# Altium schematic sheet Sheet3.SchDoc
size A4
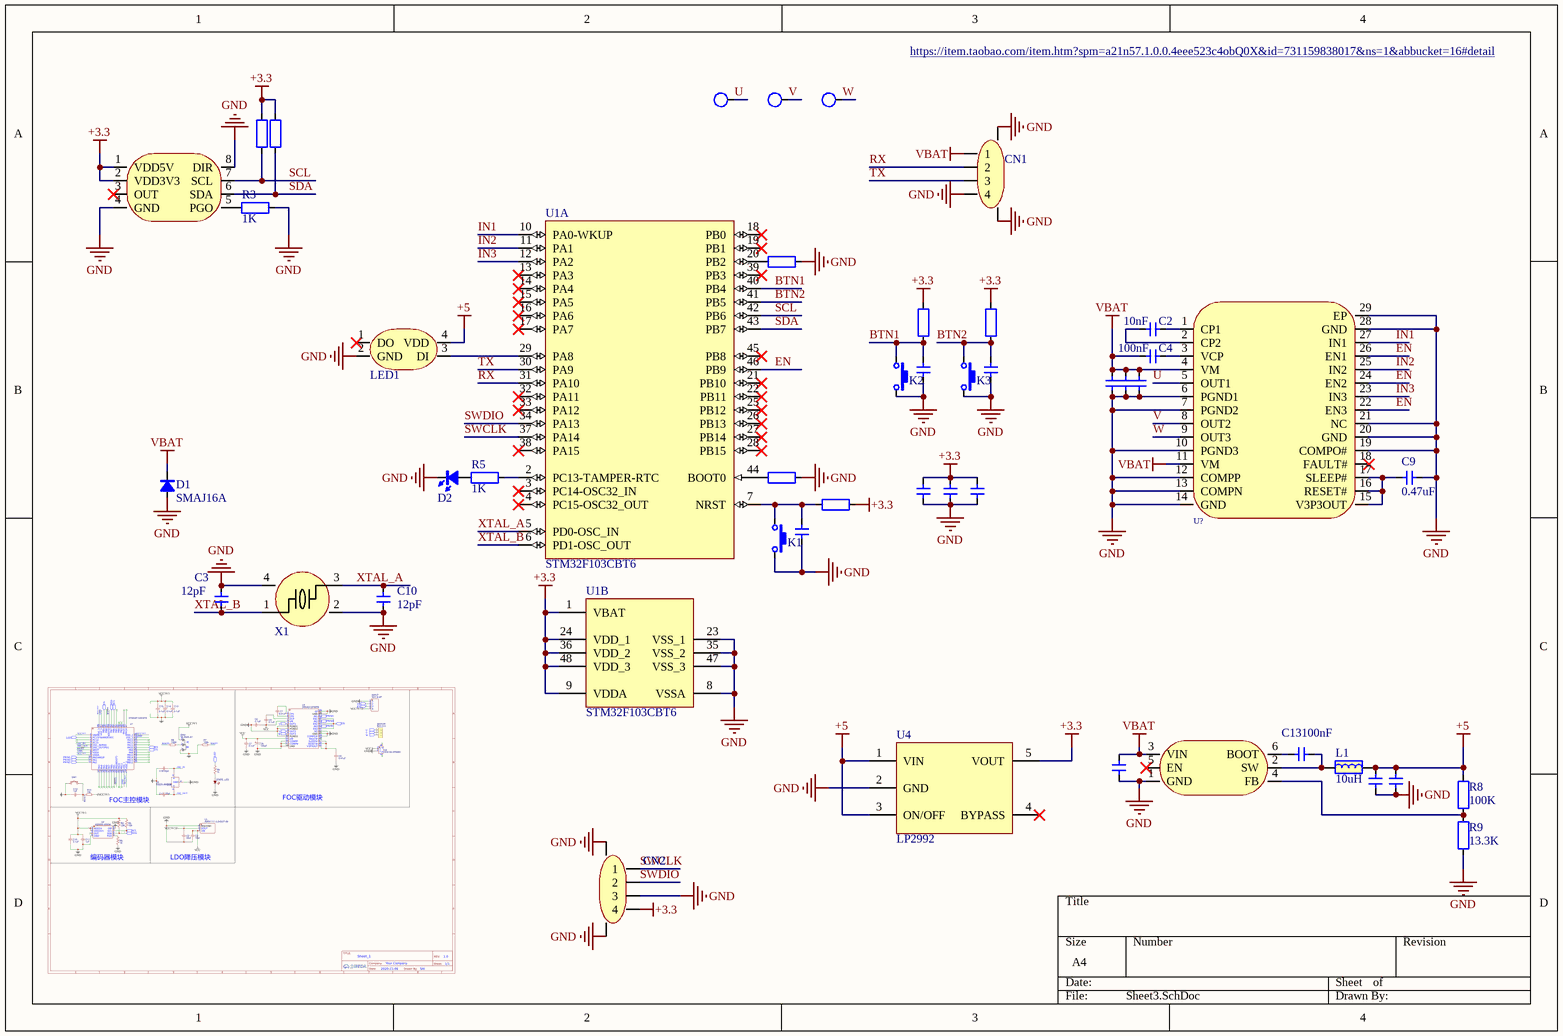
[diagram p0: Sheet3.SchDoc]

## Parts
C1  ?uF  [CAP_0402]  (value not drawn)
C2  10nF  [CAP_0402]
C3  12pF  [CAP_0402]
C4  100nF  [CAP_0402]
C5  ?uF  [CAP_0805]  (value not drawn)
C6  ?uF  [CAP_0805]  (value not drawn)
C7  ?uF  [CAP_0402]  (value not drawn)
C8  ?uF  [CAP_0402]  (value not drawn)
C9  0.47uF  [CAP_0402]
C10  12pF  [CAP_0402]
C11  ?uF  [CAP_0402]  (value not drawn)
C12  ?uF  [CAP_0402]  (value not drawn)
C13  100nF  [CAP_0402]
C14  100nF  [CAP_0402]  (value not drawn)
C15  100nF  [CAP_0603]  (value not drawn)
C16  100nF  [CAP_0603]  (value not drawn)
C17  ?uF  [CAP_0402]  (value not drawn)
C18  ?uF  [CAP_0402]  (value not drawn)
CN1  HDGC1002WR-S-4P  [SH1.0_4P]  (value not drawn)
CN2  HDGC1002WR-S-4P  [SH1.0_4P]  (value not drawn)
D1  SMAJ16A  [SMA]
D2  color?  [LED_0402]  (value not drawn)
K1  TACT 2P  [ButtonTACT_3*4*2_180]  (value not drawn)
K2  TACT 2P  [ButtonTACT_3*4*2_180]  (value not drawn)
K3  TACT 2P  [ButtonTACT_3*4*2_180]  (value not drawn)
L1  10uH  [IND-SMD_L4.0-W4.0]
LED1  WS2812B-2020  [LED-SMD_4P-L2.0-W2.0-TL_WS2812B-2020]  (value not drawn)
R1  1K  [RES_0402]  (value not drawn)
R2  1K  [RES_0402]  (value not drawn)
R3  1K  [RES_0402]
R4  1K  [RES_0402]  (value not drawn)
R5  1K  [RES_0402]
R6  1K  [RES_0402]  (value not drawn)
R7  1K  [RES_0402]  (value not drawn)
R8  100K  [RES_0402]
R9  13.3K  [RES_0402]
R10  1K  [RES_0402]  (value not drawn)
R11  1K  [RES_0402]  (value not drawn)
TEST1  TestPoint  [TestPoint_0402]  (value not drawn)
TEST2  TestPoint  [TestPoint_0402]  (value not drawn)
TEST3  TestPoint  [TestPoint_0402]  (value not drawn)
U1  STM32F103CBT6  [LQFP_48]  (parts A,B of 2)
U3  AS5600-ASOT  [SOIC-8_L4.9-W3.9-P1.27-LS6.0-BL]  (value not drawn)
U4  LP2992  [SOT23_5]
U7  TPS54202DDCR  [SOT-23-6_L2.9-W1.6-P0.95-LS2.8-BR]  (value not drawn)
U?  DRV8313PWPR  [HTSSOP_28]  (value not drawn)
X1  XYDBPCNANF-12MHZ  [CARSTAL_4P_2520]  (value not drawn)

## Nets
+3.3: C8.2 C11.2 C12.2 CN2.4 R1.2 R2.2 R7.1 R10.1 R11.1 U1.1(VBAT) U1.9(VDDA) U1.24(VDD_1) U1.36(VDD_2) U1.48(VDD_3) U3.1(VDD5V) U3.2(VDD3V3) U4.5(VOUT)
+5: C15.1 C16.1 L1.2 LED1.4(VDD) R8.2 U4.1(VIN) U4.3(ON/OFF)
GND: C1.1 C3.2 C5.1 C6.1 C7.1 C8.1 C9.1 C10.1 C11.1 C12.1 C14.1 C15.2 C16.2 C17.1 C18.1 CN1.4 CN1.5 CN1.6 CN2.3 CN2.5 CN2.6 D1.2(A) D2.2(K) K1.2 K2.2 K3.2 LED1.2(GND) R3.2 R4.1 R6.1 R9.1 U1.8(VSSA) U1.23(VSS_1) U1.35(VSS_2) U1.47(VSS_3) U3.4(GND) U3.8(DIR) U4.2(GND) U7.1(GND) U?.6(PGND1) U?.7(PGND2) U?.10(PGND3) U?.12(COMPP) U?.13(COMPN) U?.14(GND) U?.19(COMPO#) U?.20(GND) U?.21(NC) U?.28(GND) U?.29(EP) X1.2(GND) X1.4(GND)
VBAT: C4.2 C5.2 C6.2 C7.2 C14.2 CN1.1 D1.1(K) U7.3(VIN) U?.4(VM) U?.11(VM)
BTN1: C17.2 K2.1 R10.2 U1.40(PB4)
BTN2: C18.2 K3.1 R11.2 U1.41(PB5)
EN: U1.46(PB9) U?.22(EN3) U?.24(EN2) U?.26(EN1)
IN1: U1.10(PA0-WKUP) U?.27(IN1)
IN2: U1.11(PA1) U?.25(IN2)
IN3: U1.12(PA2) U?.23(IN3)
RX: CN1.2 U1.31(PA10)
SCL: R1.1 U1.42(PB6) U3.7(SCL)
SDA: R2.1 U1.43(PB7) U3.6(SDA)
SWCLK: CN2.1 U1.37(PA14)
SWDIO: CN2.2 U1.34(PA13)
TX: CN1.3 U1.30(PA9)
U: TEST1.1 U?.5(OUT1)
V: TEST2.1 U?.8(OUT2)
W: TEST3.1 U?.9(OUT3)
XTAL_A: C10.2 U1.5(PD0-OSC_IN) X1.3
XTAL_B: C3.1 U1.6(PD1-OSC_OUT) X1.1
NetC1_2: C1.2 K1.1 R7.2 U1.7(NRST)
NetC2_1: C2.1 U?.1(CP1)
NetC2_2: C2.2 U?.2(CP2)
NetC4_1: C4.1 U?.3(VCP)
NetC9_2: C9.2 U?.15(V3P3OUT) U?.16(RESET#) U?.17(SLEEP#)
NetC13_1: C13.1 L1.1 U7.2(SW)
NetC13_2: C13.2 U7.6(BOOT)
NetD2_1: D2.1(A) R5.1
NetLED1_3: LED1.3(DI) U1.29(PA8)
NetR3_1: R3.1 U3.5(PGO)
NetR4_2: R4.2 U1.20(PB2)
NetR5_2: R5.2 U1.2(PC13-TAMPER-RTC)
NetR6_2: R6.2 U1.44(BOOT0)
NetR8_1: R8.1 R9.2 U7.4(FB)

Not connected (* = marked no-connect by the designer): LED1 1(DO)*; U1 3(PC14-OSC32_IN)* 4(PC15-OSC32_OUT)* 13(PA3)* 14(PA4)* 15(PA5)* 16(PA6)* 17(PA7)* 18(PB0)* 19(PB1)* 21(PB10)* 22(PB11)* 25(PB12)* 26(PB13)* 27(PB14)* 28(PB15)* 32(PA11)* 33(PA12)* 38(PA15)* 39(PB3)* 45(PB8)*; U3 3(OUT)*; U4 4(BYPASS)*; U7 5(EN)*; U? 18(FAULT#)*

## Notes on the sheet
- https://item.taobao.com/item.htm?spm=a21n57.1.0.0.4eee523c4obQ0X&id=731159838017&ns=1&abbucket=16#detail

## Library data of the parts
C1-C18 = Capacitor_MLCC
CN1 CN2 = 4P端子: Manufacturer: HDGC(华德共创); Add into BOM: yes; Name: HDGC1002WR-S-4P; Symbol: HDGC1002WR-S-4P; Device: HDGC1002WR-S-4P; LCSC Part Name: SH1.0针座卧贴 4P; Supplier Part: C2936214; Manufacturer Part: HDGC1002WR-S-4P; Supplier Footprint: SMD,P=1mm; JLCPCB Part Class: 扩展库; Datasheet: https://atta.szlcsc.com/upload/public/pdf/source/20211229/E8A09E85670B5E97244D2008A24D97FE.pdf; Supplier: LCSC; Convert to PCB: yes
D1 = Diode_SMD: Value: color?
D2 = LED: Value: color?
K1-K3 = Button_2P: Button; type: TACT 2P
L1 = Inductor_SMD
LED1 = WS2812B-2020: 发光颜色:RGB三色;二极管配置:-;透镜颜色:-;主波长:470.4nm；622.5nm；515.6nm;峰值波长:-;色温:-;测试电流:12mA;功率:-;发光角度:-;安装方式:-;工作温度:-;; Manufacturer: worldsemi; Add into BOM: yes; Emitted Color: RGB三色; Forward Current: 12mA; Name: WS2812B-2020; Symbol: WS2812B-2020; Device: WS2812B-2020; LCSC Part Name: RGB三色 470.4nm 515.6nm 622.5nm （注意防潮，请查阅规格书中对应具体内容）; Supplier Part: C965555; Manufacturer Part: WS2812B-2020; Supplier Footprint: SMD,2x2mm; JLCPCB Part Class: 扩展库; Datasheet: https://atta.szlcsc.com/upload/public/pdf/source/20201203/C965555_5C919C4B6231E6ADE06011FB0D94282B.pdf; Supplier: LCSC; Convert to PCB: yes; Diode Configuration: -; Lens Color: -; Dominant Wavelength: 470.4nm；622.5nm；515.6nm; Peak Wavelength: -; Color Temperature: -; Power Dissipation: -; Viewing Angle: -; Mounting Sytle: -; Operating Temperature: -
R1-R11 = Resistor_SMD: Value: 22R
U1 = STM32F103CBT6: ARM Cortex-M3 32-bit MCU, 128 KB Flash, 20 KB Internal RAM, 37 I/Os, 48-pin LQFP, -40 to 85 degC, Tray; A/D Converter: 2x12-bit (10 Channel); FLASH Size (Prog) (kB): 128; I/Os (High Current): 37; Internal RAM Size (kB): 20; Operating Frequency(F) (Processor speed) (MHz): 72; Supply Voltage(Vcc) min (V): 2; DatasheetVersion: Rev. 16; PackageVersion: Rev. 6, 06/2013; PackageReference: LQFP48; PackageDescription: 48-Pin Low Profile Quad Flat Package, 7 x 7 mm Body, 0.5 mm Pitch; Supplier 1: Digi-Key; Supplier Part Number 1: 497-6288-ND; Supplier 2: Farnell; Supplier Part Number 2: 1606327; Supplier 3: Newark; Supplier Part Number 3: 11N8296; Supplier 4: Newark; Supplier Part Number 4: 57P1214; Supplier 5: Mouser; Supplier Part Number 5: 511-STM32F103CBT6; Core: ARM Cortex-M3; Packing: Tray; Mounting Technology: Surface Mount; PartNumber: STM32F103CBT6; ComponentLink1Description: Manufacturer URL; ComponentLink1URL: http://www.st.com/web/en/home.html; ComponentLink2Description: Datasheet; ComponentLink2URL: http://www.st.com/st-web-ui/static/active/en/resource/technical/document/datasheet/CD00161566.pdf; ComponentLink3Description: Package Specification; ComponentLink3URL: http://www.st.com/st-web-ui/static/active/en/resource/technical/document/datasheet/DM00058181.pdf
U3 = AS5600-ASOT: Manufacturer: ams(艾迈斯半导体); Add into BOM: yes; Name: AS5600-ASOT; Symbol: AS5600-ASOT; Device: AS5600-ASOT; LCSC Part Name: AS5600-ASOT; Supplier Part: C499458; Manufacturer Part: AS5600-ASOT; Supplier Footprint: SOIC-8; JLCPCB Part Class: Extended Part; Datasheet: https://atta.szlcsc.com/upload/public/pdf/source/20200324/C499458_E1461AFB0CE1042DE5756821C534625C.pdf; Supplier: LCSC; Convert to PCB: yes
U4 = LP2992: LP2992_LDO
U7 = TPS54202DDCR: Manufacturer: TI(德州仪器); Add into BOM: yes; Name: TPS54202DDCR; Symbol: TPS54202DDCR; Device: TPS54202DDCR; LCSC Part Name: TPS54202DDCR; Supplier Part: C191884; Manufacturer Part: TPS54202DDCR; Supplier Footprint: SOT-23-6; JLCPCB Part Class: Extended Part; Datasheet: https://atta.szlcsc.com/upload/public/pdf/source/20181012/C191884_C6DBFD980275651BD8C8F427C2E48058.pdf; Supplier: LCSC; Convert to PCB: yes
U? = DRV8313PWPR: 类型:无刷直流BLDC;电源电压:8V~60V;输出电流:-;接口:并行;; Manufacturer: TI(德州仪器); Add into BOM: yes; Supply Voltage: 8V~60V; Interface: 并行; Name: DRV8313PWPR; Symbol: DRV8313PWPR; Device: DRV8313PWPR; LCSC Part Name: 无刷直流BLDC电机驱动芯片 60V; Supplier Part: C92482; Manufacturer Part: DRV8313PWPR; Supplier Footprint: TSSOP-28-EP; JLCPCB Part Class: 扩展库; Datasheet: https://www.ti.com/cn/lit/gpn/drv8313; Supplier: LCSC; Convert to PCB: yes; Type: 无刷直流BLDC; Output Current: -; Operating Temperature: -40℃~+150℃@(Tj)
X1 = Crystal_4P: 四脚无源晶振; Manufacturer: TAITIEN(泰艺电子); Add into BOM: yes; Name: -; Symbol: XYDBPCNANF-12MHZ; Device: XYDBPCNANF-12MHZ; Convert to PCB: yes; LCSC Part Name: 12MHz 12pF ±10ppm -20~+70℃; Supplier Part: C521567; Manufacturer Part: XYDBPCNANF-12MHZ; Supplier Footprint: SMD2520-4P; JLCPCB Part Class: 扩展库; Datasheet: https://atta.szlcsc.com/upload/public/pdf/source/20200427/C521567_8D8DDB0F2E066B5BAD7A5878EBE465E2.pdf; Supplier: LCSC; Crystal Type: -; Value: -; Frequency Tolerance: -; Frequency Stability: -; Load Capacitance: -; Operating Temperature: -